# EAGLE design steamer-deck-ino (EAGLE 5.11)
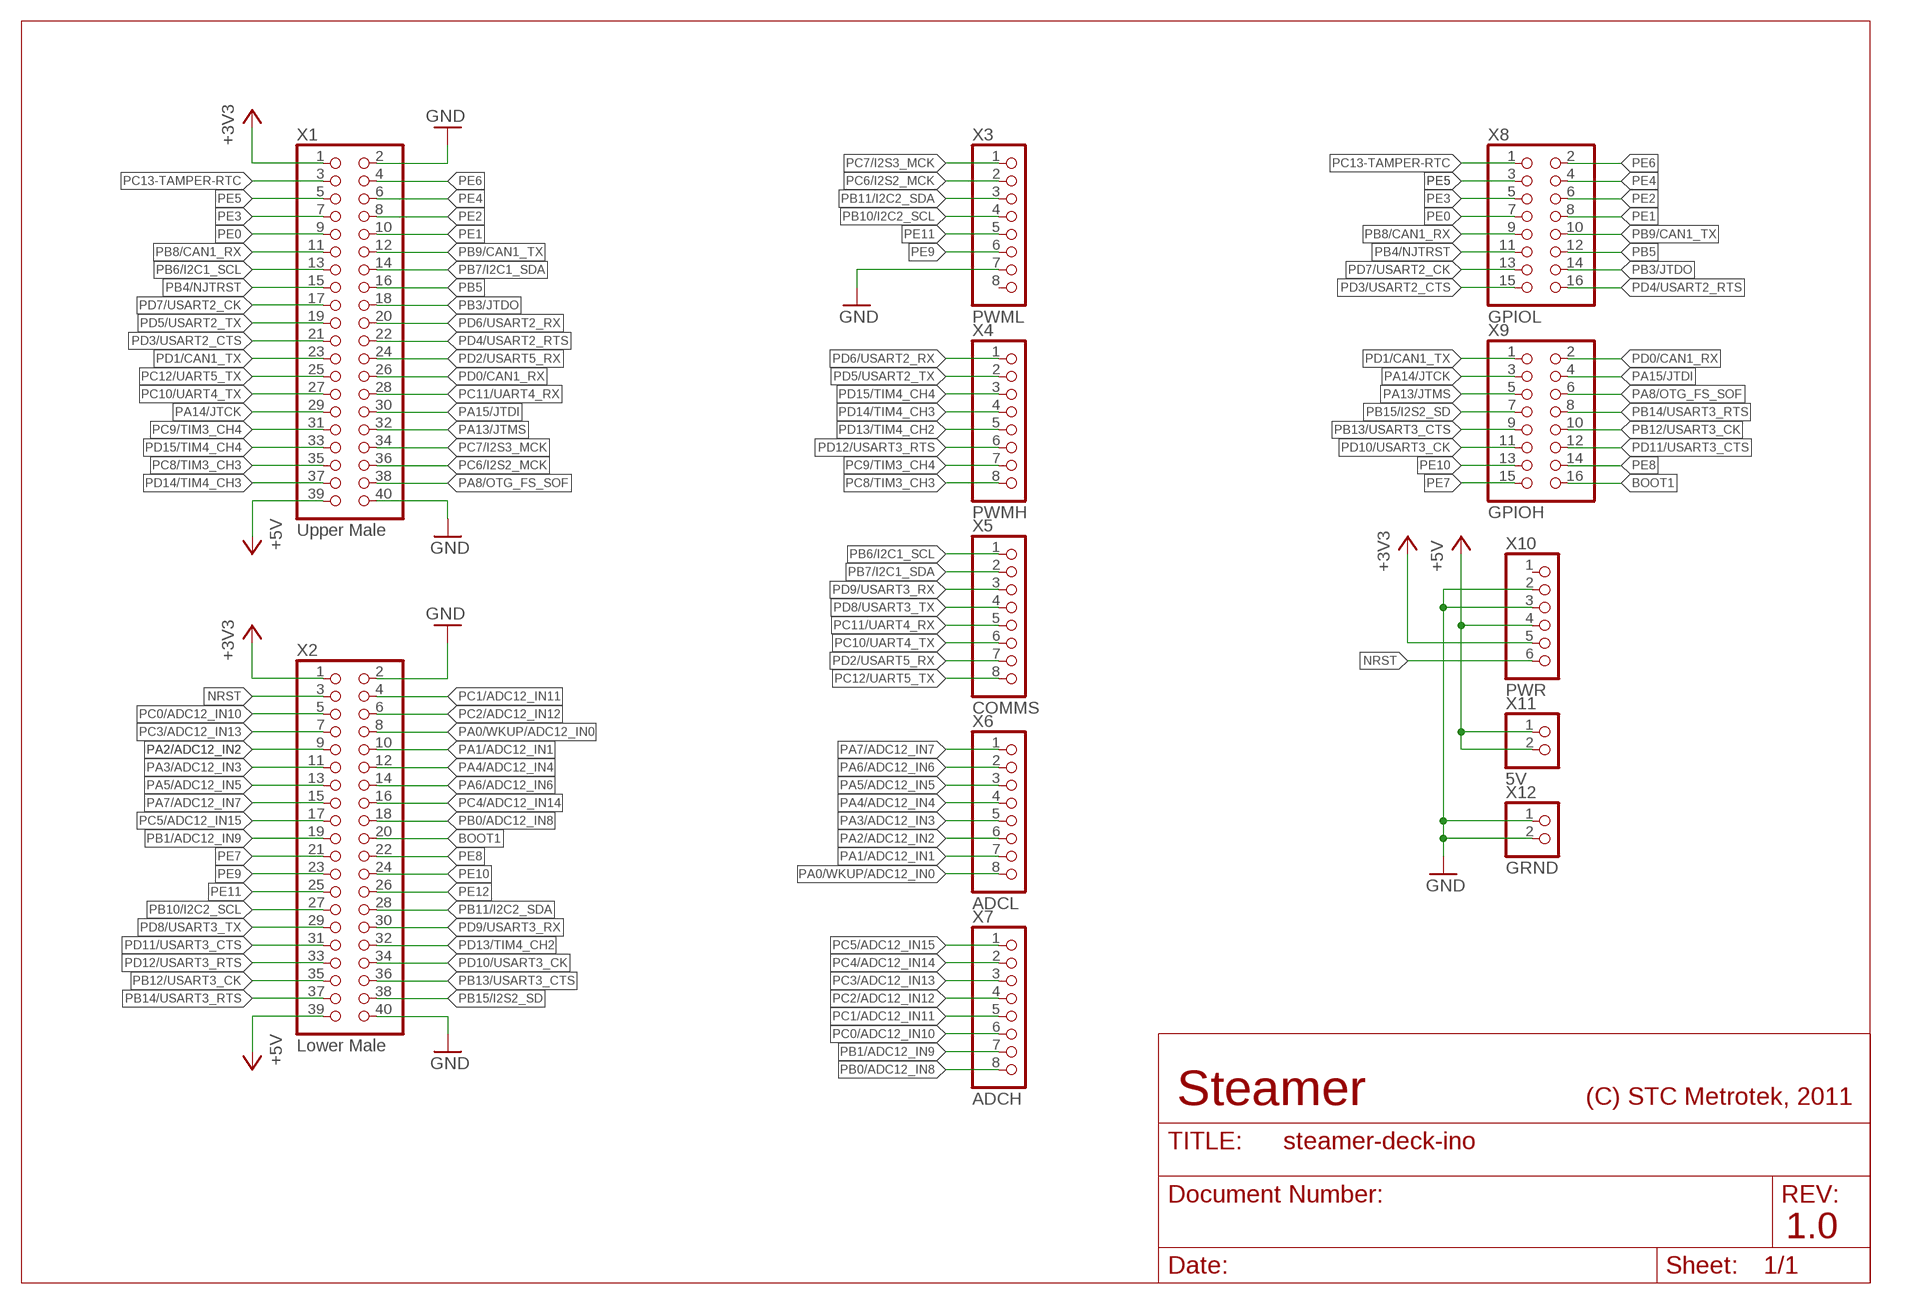
[diagram p0: schematic, sheet 1]

## Parts
X1  Upper Male  PINHD-2X20-M  [2X20SMD1-27-BB-M]
X2  Lower Male  PINHD-2X20-M  [2X20SMD1-27-BB-M]
X3  PWML  PINHD-1X8  [1X08]
X4  PWMH  PINHD-1X8  [1X08]
X5  COMMS  PINHD-1X8  [1X08]
X6  ADCL  PINHD-1X8  [1X08]
X7  ADCH  PINHD-1X8  [1X08]
X8  GPIOL  PINHD-2X8  [2X08]
X9  GPIOH  PINHD-2X8  [2X08]
X10  PWR  PINHD-1X6  [1X06]
X11  5V  PINHD-1X2  [1X02]
X12  GRND  PINHD-1X2  [1X02]

## Nets
+3V3: X1.1 X2.1 X10.5
+5V: X1.39 X2.39 X10.4 X11.1 X11.2
BOOT1: X2.20 X9.16
GND: X1.2 X1.40 X2.2 X2.40 X3.7 X10.2 X10.3 X12.1 X12.2
NRST: X2.3 X10.6
PA0/WKUP/ADC12_IN0: X2.8 X6.8
PA1/ADC12_IN1: X2.10 X6.7
PA2/ADC12_IN2: X2.9 X6.6
PA3/ADC12_IN3: X2.11 X6.5
PA4/ADC12_IN4: X2.12 X6.4
PA5/ADC12_IN5: X2.13 X6.3
PA6/ADC12_IN6: X2.14 X6.2
PA7/ADC12_IN7: X2.15 X6.1
PA8/OTG_FS_SOF: X1.38 X9.6
PA13/JTMS: X1.32 X9.5
PA14/JTCK: X1.29 X9.3
PA15/JTDI: X1.30 X9.4
PB0/ADC12_IN8: X2.18 X7.8
PB1/ADC12_IN9: X2.19 X7.7
PB3/JTDO: X1.18 X8.14
PB4/NJTRST: X1.15 X8.11
PB5: X1.16 X8.12
PB6/I2C1_SCL: X1.13 X5.1
PB7/I2C1_SDA: X1.14 X5.2
PB8/CAN1_RX: X1.11 X8.9
PB9/CAN1_TX: X1.12 X8.10
PB10/I2C2_SCL: X2.27 X3.4
PB11/I2C2_SDA: X2.28 X3.3
PB12/USART3_CK: X2.35 X9.10
PB13/USART3_CTS: X2.36 X9.9
PB14/USART3_RTS: X2.37 X9.8
PB15/I2S2_SD: X2.38 X9.7
PC0/ADC12_IN10: X2.5 X7.6
PC1/ADC12_IN11: X2.4 X7.5
PC2/ADC12_IN12: X2.6 X7.4
PC3/ADC12_IN13: X2.7 X7.3
PC4/ADC12_IN14: X2.16 X7.2
PC5/ADC12_IN15: X2.17 X7.1
PC6/I2S2_MCK: X1.36 X3.2
PC7/I2S3_MCK: X1.34 X3.1
PC8/TIM3_CH3: X1.35 X4.8
PC9/TIM3_CH4: X1.31 X4.7
PC10/UART4_TX: X1.27 X5.6
PC11/UART4_RX: X1.28 X5.5
PC12/UART5_TX: X1.25 X5.8
PC13-TAMPER-RTC: X1.3 X8.1
PD0/CAN1_RX: X1.26 X9.2
PD1/CAN1_TX: X1.23 X9.1
PD2/USART5_RX: X1.24 X5.7
PD3/USART2_CTS: X1.21 X8.15
PD4/USART2_RTS: X1.22 X8.16
PD5/USART2_TX: X1.19 X4.2
PD6/USART2_RX: X1.20 X4.1
PD7/USART2_CK: X1.17 X8.13
PD8/USART3_TX: X2.29 X5.4
PD9/USART3_RX: X2.30 X5.3
PD10/USART3_CK: X2.34 X9.11
PD11/USART3_CTS: X2.31 X9.12
PD12/USART3_RTS: X2.33 X4.6
PD13/TIM4_CH2: X2.32 X4.5
PD14/TIM4_CH3: X1.37 X4.4
PD15/TIM4_CH4: X1.33 X4.3
PE0: X1.9 X8.7
PE1: X1.10 X8.8
PE2: X1.8 X8.6
PE3: X1.7 X8.5
PE4: X1.6 X8.4
PE5: X1.5 X8.3
PE6: X1.4 X8.2
PE7: X2.21 X9.15
PE8: X2.22 X9.14
PE9: X2.23 X3.6
PE10: X2.24 X9.13
PE11: X2.25 X3.5
PE12: X2.26
Unconnected: X3.8 X10.1

## Notes on the sheet
- Steamer | (C) STC Metrotek, 2011
- 1.0

## Library data of the parts
X1 X2 = con-pinhd-2x20:PINHD-2X20: PIN HEADER
X3-X7 = steamer-pinhead:PINHD-1X8: PIN HEADER
X8 X9 = pinhead:PINHD-2X8: PIN HEADER
X10 = steamer-pinhead:PINHD-1X6: PIN HEADER
X11 X12 = steamer-pinhead:PINHD-1X2: PIN HEADER

## Net classes
0 default: width 0.254 mm
1 GND: width 0.305 mm
2 +3V3: width 0.305 mm
3 +5V: width 0.305 mm
4 USB_VDD: width 0.254 mm
5 SUPP: width 0.305 mm

## Board
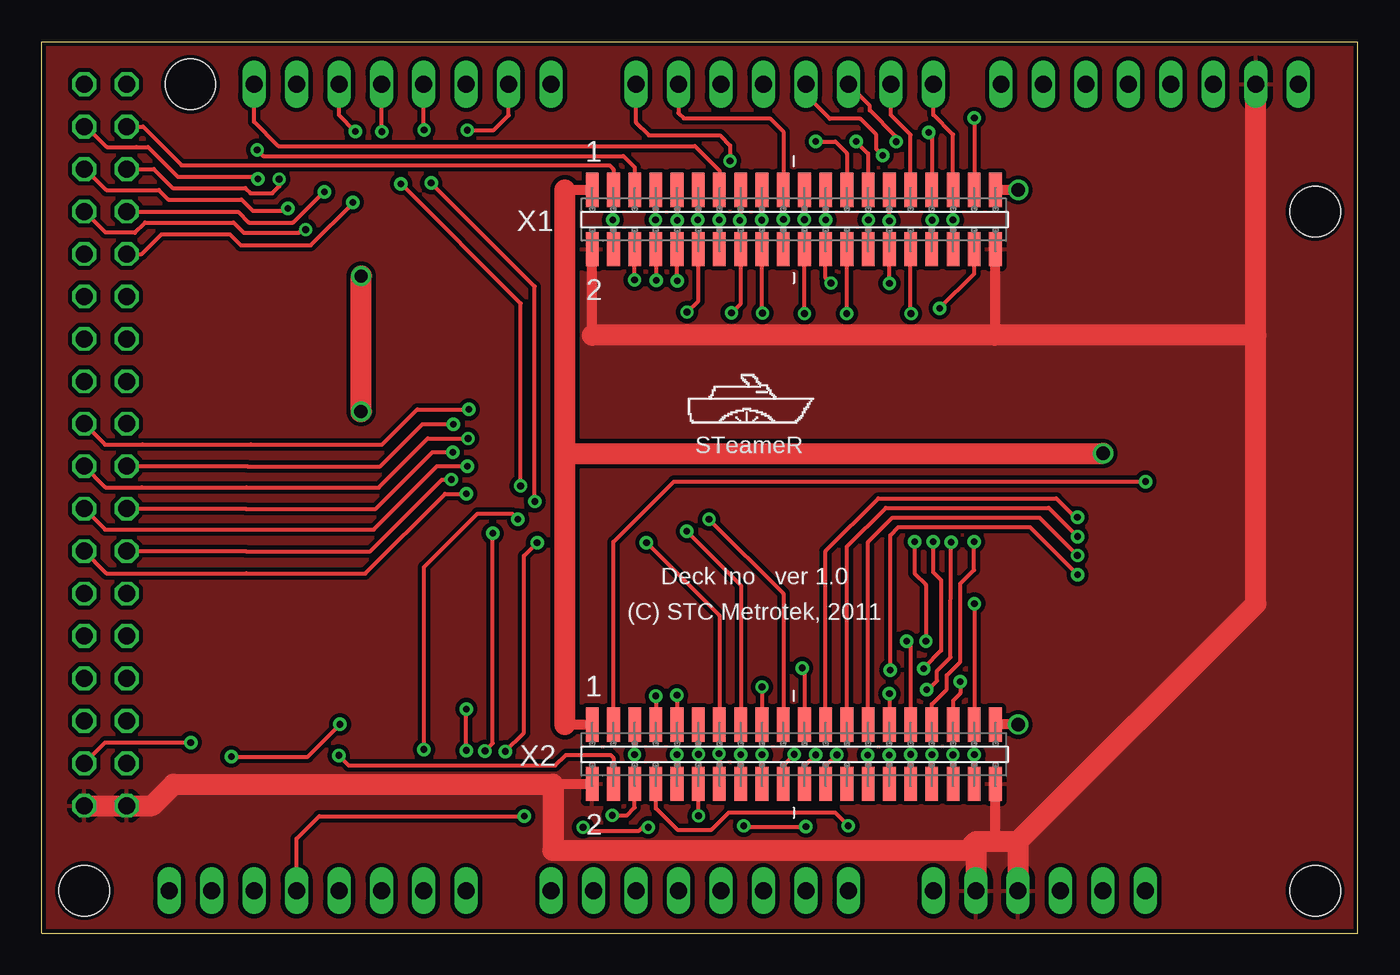
[diagram p1: board, top side]
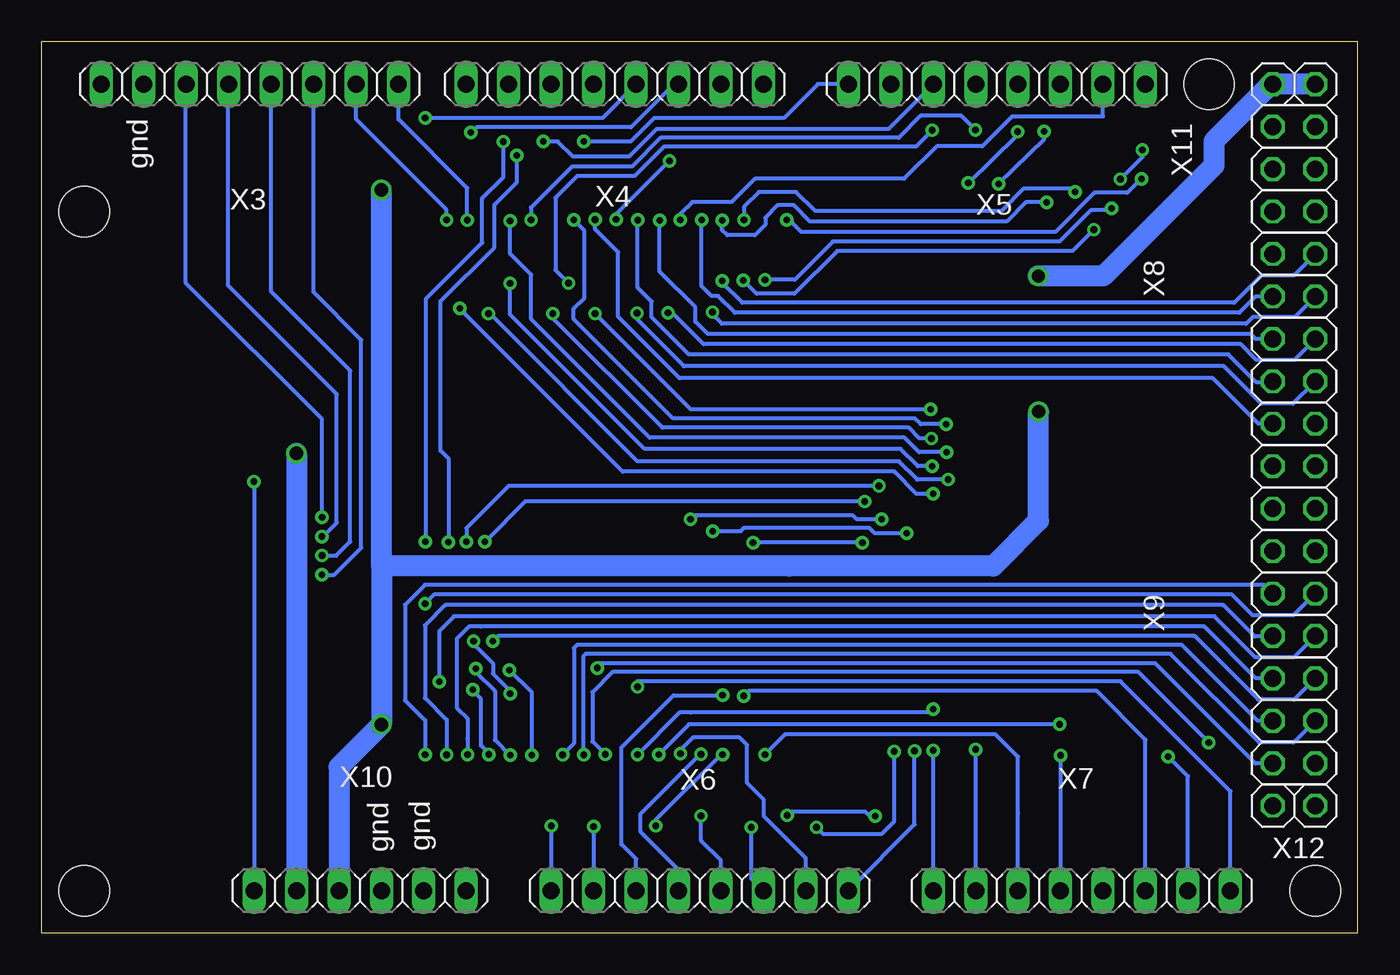
[diagram p2: board, bottom side, seen from below]

Size 78.74 x 53.34 mm. Coordinates in mm from the lower left corner, seen from the top.
Outline: 0,0 0,53.34 78.74,53.34 78.74,0 0,0
Copper layers (1*16): Top 0.035mm / dielectric 1.43mm / Bottom 0.035mm
Design rules "default *": minimum track width 10mil, minimum drill 0.4mm, track to track 10mil, track to pad 10mil, pad to pad 10mil, via to via 10mil, smd to smd 10mil, copper to edge 0.25mm, drill to drill 0.4mm, minimum pad ring 0.2mm, minimum via ring 0.2mm, stop-mask expansion 0.1mm, vias tented up to drill 0.4mm, thermal gap 12mil
Holes 3 mm at 8.89,50.8 76.2,2.54 76.2,43.18 2.54,2.54

### Footprints (pad centres in the part's own frame; a part is rotated, then mirrored left to right if it is on the bottom)
2X20SMD1-27-BB-M = smd 0.76 x 2.05: 1 -12.065,1.775; 2 -12.065,-1.775; 3 -10.795,1.775; 4 -10.795,-1.775; 5 -9.525,1.775; 6 -9.525,-1.775; 7 -8.255,1.775; 8 -8.255,-1.775; 9 -6.985,1.775; 10 -6.985,-1.775; 11 -5.715,1.775; 12 -5.715,-1.775; 13 -4.455,1.775; 14 -4.455,-1.775; 15 -3.175,1.775; 16 -3.175,-1.775; 17 -1.905,1.775; 18 -1.905,-1.775; 19 -0.635,1.775; 20 -0.635,-1.775; 21 0.635,1.775; 22 0.635,-1.775; 23 1.905,1.775; 24 1.905,-1.775; 25 3.175,1.775; 26 3.175,-1.775; 27 4.445,1.775; 28 4.445,-1.775; 29 5.715,1.775; 30 5.715,-1.775; 31 6.985,1.775; 32 6.985,-1.775; 33 8.255,1.775; 34 8.255,-1.775; 35 9.525,1.775; 36 9.525,-1.775; 37 10.795,1.775; 38 10.795,-1.775; 39 12.065,1.775; 40 12.065,-1.775
1X08 = drill 1.016 long: 1 -8.89,0; 2 -6.35,0; 3 -3.81,0; 4 -1.27,0; 5 1.27,0; 6 3.81,0; 7 6.35,0; 8 8.89,0
2X08 = drill 1.016 octagon: 1 -8.89,-1.27; 2 -8.89,1.27; 3 -6.35,-1.27; 4 -6.35,1.27; 5 -3.81,-1.27; 6 -3.81,1.27; 7 -1.27,-1.27; 8 -1.27,1.27; 9 1.27,-1.27; 10 1.27,1.27; 11 3.81,-1.27; 12 3.81,1.27; 13 6.35,-1.27; 14 6.35,1.27; 15 8.89,-1.27; 16 8.89,1.27
1X06 = drill 1.016 long: 1 -6.35,0; 2 -3.81,0; 3 -1.27,0; 4 1.27,0; 5 3.81,0; 6 6.35,0
1X02 = drill 1.016 octagon: 1 -1.27,0; 2 1.27,0

### Placement (x,y rotation side)
X1  45,42.7 0 top
X2  45,10.7 0 top
X3  66.29,50.8 180 bottom
X4  44.45,50.8 180 bottom
X5  21.59,50.8 180 bottom
X6  39.37,2.54 180 bottom
X7  16.51,2.54 180 bottom
X8  3.81,39.37 270 bottom
X9  3.81,19.05 270 bottom
X10  59.69,2.54 180 bottom
X11  3.81,50.8 0 bottom
X12  3.81,7.62 0 bottom

### Tracks (layer width: path | path; a pad name or v marks a point on that pad's centre or on a via)
+3V3  (via drill 0.8)
  Top 0.61: 31.3,12.47 X2.1 | 31.3,44.49 X1.1
  Top 1.27: 31.3,28.76 31.3,44.49 | v63.51,28.7 31.36,28.7 31.3,28.76 | 31.3,12.47 31.3,28.76
  Bottom 1.27: v63.51,28.7 X10.5
+5V  (via drill 0.8)
  Top 0.61: X2.39 v58.42,12.48 | v58.42,44.48 X1.39
  Top 1.27: v19.11,39.32 v19.11,31.22 v19.1,31.21
  Bottom 1.27: X10.4 60.96,9.94 v58.42,12.48 58.42,21.98 | 58.42,21.98 v58.42,44.48 | X11.2 X11.1 5.2,50.8 8.61,47.39 | 58.42,21.98 34.02,21.98 34.01,21.97 21.81,21.97 19.1,24.68 v19.1,31.21 | 8.61,47.39 8.6,47.38 | 8.61,47.39 8.61,45.94 15.23,39.32 v19.11,39.32
BOOT1  (via drill 0.4)
  Top 0.254: v8.91,11.4 3.79,11.4 X9.16 | X2.20 44.37,10.04 v45.02,10.7
  Bottom 0.254: v8.91,11.4 13.12,15.62 44.59,15.62 45.79,14.41 45.79,11.47 v45.02,10.7
GND
  Top 0.61: 32.93,35.78 X1.2 | X1.40 57.06,35.78 57.03,35.78 | 57.06,5.48 X2.40 | X2.2 30.59,8.93 30.59,8.91
  Top 1.27: 72.64,35.78 X3.7 | 32.93,35.78 57.03,35.78 72.64,35.78 | X12.2 X12.1 6.6,7.62 7.89,8.91 30.59,8.91 30.59,4.96 30.59,4.95 55.38,4.95 55.91,5.48 | 55.91,5.48 57.06,5.48 58.42,5.48 | 58.42,5.48 X10.3 | X10.2 55.91,2.54 55.91,5.48 | 58.42,5.48 72.64,19.7 72.64,35.78
  pour Top: 0,0 78.74,0 78.74,53.31 0,53.31
NRST  (via drill 0.4)
  Top 0.254: v66.05,27.02 37.82,27.02 34.21,23.41 X2.3
  Bottom 0.254: X10.6 v66.04,27.01 v66.05,27.02
PA0/WKUP/ADC12_IN0  (via drill 0.4)
  Top 0.254: X2.8 36.74,7.46 38.03,6.18 40.07,6.18 41.11,7.22 47.46,7.22 v48.26,6.42
  Bottom 0.254: v48.26,6.42 X6.8
PA1/ADC12_IN1  (via drill 0.4)
  Top 0.254: X2.10 v38.02,10.67 v38.01,10.68 | v42.01,6.42 42.05,6.37 v45.72,6.37
  Bottom 0.254: v38.01,10.68 38.17,10.68 38.17,10.62 42.01,6.78 v42.01,6.42 | v45.72,6.37 X6.7
PA2/ADC12_IN2  (via drill 0.4)
  Top 0.254: X2.9 38.02,14.31 v38.01,14.23
  Bottom 0.254: v38.01,14.23 40.94,14.23 44.06,11.11 44.06,5.31 43.18,4.43 X6.6
PA3/ADC12_IN3  (via drill 0.4)
  Top 0.254: X2.11 39.28,10.71 v39.3,10.7
  Bottom 0.254: v39.3,10.7 39.35,10.7 42.91,7.14 42.91,6.06 40.64,3.79 X6.5
PA4/ADC12_IN4  (via drill 0.4)
  Top 0.254: X2.12 39.28,7.03 v39.3,7.02
  Bottom 0.254: v39.3,7.02 39.3,5.53 38.1,4.34 X6.4
PA5/ADC12_IN5  (via drill 0.4)
  Top 0.254: X2.13 40.55,19 v36.18,23.37 | v27.73,10.87 28.85,11.99 28.85,22.57 v29.64,23.36 v29.64,23.37 | v32.39,6.33 32.59,6.13 35.75,6.13 35.95,6.33 v36.29,6.33
  Bottom 0.254: X6.3 36.29,3.27 v36.29,6.33 | v32.39,6.33 31.98,5.92 28.5,5.92 27.73,6.69 v27.73,10.87 | v29.64,23.37 v36.18,23.37
PA6/ADC12_IN6  (via drill 0.4)
  Top 0.254: X2.14 40.55,10.72 v40.52,10.74
  Bottom 0.254: v40.52,10.74 40.52,10.95 39.77,11.71 36.98,11.71 36.53,11.26 36.53,8.98 35.53,7.98 35.53,7 33.02,4.48 X6.2
PA7/ADC12_IN7  (via drill 0.4)
  Top 0.254: X2.15 41.83,20.82 v38.6,24.04 | v26.98,23.92 26.98,11.36 v26.52,10.9
  Bottom 0.254: v38.6,24.04 36.93,24.04 36.74,24.23 29.21,24.23 28.9,23.92 v26.98,23.92 | v26.52,10.9 26.52,6.5 X6.1
PA8/OTG_FS_SOF  (via drill 0.4)
  Top 0.254: X9.6 3.87,21.54 12.24,21.54 12.26,21.52 19.36,21.52 24.13,26.29 v25.4,26.29 | X1.38 55.8,39.47 v53.73,37.4
  Bottom 0.254: v25.4,26.29 26.41,26.29 27.73,27.61 43.99,27.61 53.45,37.08 53.45,37.12 v53.73,37.4
PA13/JTMS  (via drill 0.4)
  Top 0.254: X1.32 51.98,37.09 v52.01,37.07 | X9.5 12.19,22.86 12.2,22.85 19.66,22.85 23.95,27.14 v24.5,27.14
  Bottom 0.254: v24.5,27.14 v24.51,27.14 26.36,27.14 27.45,28.23 43.08,28.23 51.92,37.07 v52.01,37.07
PA14/JTCK  (via drill 0.4)
  Top 0.254: v50.72,42.62 X1.29 | X9.3 6.22,25.41 6.23,25.4 12.2,25.4 12.21,25.39 19.98,25.39 23.37,28.78 v24.59,28.78
  Bottom 0.254: v50.72,42.62 50.72,40.66 49.46,39.41 49.46,36.74 42.37,29.65 27.12,29.65 26.25,28.78 v24.59,28.78
PA15/JTDI  (via drill 0.4)
  Top 0.254: X9.4 3.79,24.14 12.18,24.14 12.18,24.15 19.86,24.15 23.65,27.94 v25.45,27.94 v25.46,27.93 | X1.30 v50.72,38.88
  Bottom 0.254: v50.72,38.88 v50.71,38.87 50.71,37.01 42.67,28.97 27.35,28.97 26.32,27.94 v25.46,27.94 v25.46,27.93
PB0/ADC12_IN8  (via drill 0.4)
  Top 0.254: v43.09,10.68 X2.18 | v25.4,10.93 v25.4,13.41
  Bottom 0.254: v43.09,10.68 40.58,13.2 39.91,13.2 39.88,13.21 25.59,13.21 v25.4,13.41 | X7.8 v25.4,10.93
PB1/ADC12_IN9  (via drill 0.4)
  Top 0.254: X2.19 44.37,20.32 v39.92,24.76 | v28.49,24.76 28.14,25.11 26.08,25.11 22.87,21.9 v22.87,10.99
  Bottom 0.254: X7.7 v22.86,10.98 v22.87,10.99 | v39.92,24.76 39.7,24.98 30.19,24.98 29.97,24.76 v28.49,24.76
PB3/JTDO  (via drill 0.4)
  Top 0.254: X1.18 43.09,37.12 v43.12,37.1
  Bottom 0.254: v43.12,37.1 43.12,36.73 40.32,33.93 8.02,33.93 5.77,31.68 3.88,31.68 X8.14
PB4/NJTRST  (via drill 0.4)
  Top 0.254: X1.15 41.83,42.7 v41.77,42.65
  Bottom 0.254: v41.77,42.65 41.77,39.6 39.63,37.46 39.63,36.59 38.89,35.85 6.39,35.85 6.1,35.56 X8.11
PB5  (via drill 0.4)
  Top 0.254: X1.16 41.83,37.67 v41.27,37.12
  Bottom 0.254: v41.27,37.12 41.02,37.12 39.14,35.24 7,35.24 6.06,34.3 3.8,34.3 X8.12
PB6/I2C1_SCL
  Top 0.254: X1.13 40.55,45.64 39.08,47.1 14.15,47.1 12.7,48.55 X5.1
PB7/I2C1_SDA  (via drill 0.4)
  Top 0.254: X1.14 v40.55,42.68 v40.54,42.69
  Bottom 0.254: v40.54,42.69 40.54,43.02 39.8,43.75 37.47,43.75 36.08,45.14 27.14,45.14 25.19,47.09 22.46,47.09 20.68,48.87 15.24,48.87 X5.2
PB8/CAN1_RX  (via drill 0.4)
  Top 0.254: X1.11 39.28,42.7 v39.26,42.67
  Bottom 0.254: v39.26,42.67 39.26,38.7 38.68,38.13 38.27,38.13 37.27,37.13 7.08,37.13 6.13,38.08 5.1,38.08 X8.9
PB9/CAN1_TX  (via drill 0.4)
  Top 0.254: X1.12 39.28,37.84 v38.61,37.16
  Bottom 0.254: v38.61,37.16 38.61,37.04 38.04,36.47 6.67,36.47 6.27,36.87 3.77,36.87 X8.10
PB10/I2C2_SCL  (via drill 0.4)
  Top 0.254: v61.97,22.59 59.7,24.87 50.91,24.87 49.45,23.41 X2.27
  Bottom 0.254: v61.97,22.59 61.12,22.59 60.28,23.43 60.28,33.66 65.03,38.4 X3.4
PB11/I2C2_SDA  (via drill 0.4)
  Top 0.254: X2.28 49.45,10.62 v49.41,10.65 | v61.98,21.45 v61.98,21.44 59.13,24.29 51.25,24.29 50.77,23.8 v50.77,15.74
  Bottom 0.254: 50.74,15.71 v50.77,15.74 49.41,14.39 v49.41,10.65 | v61.98,21.44 61.24,21.44 59.62,23.06 59.62,35.5 62.48,38.36 X3.3
PB12/USART3_CK  (via drill 0.4)
  Top 0.254: X2.35 54.52,13.91 54.96,14.35 v54.96,15.04
  Bottom 0.254: X9.10 3.81,16.5 6.13,16.5 8.57,18.95 54.07,18.95 54.96,18.06 v54.96,15.04
PB13/USART3_CTS  (via drill 0.4)
  Top 0.254: X2.36 v54.52,10.66 v54.52,10.67
  Bottom 0.254: X9.9 5.12,17.74 6.16,17.74 8.05,19.63 54.6,19.63 55.81,18.43 55.81,14.06 54.52,12.77 v54.52,10.67
PB14/USART3_RTS  (via drill 0.4)
  Top 0.254: X2.37 v55.8,19.71 v55.8,19.72
  Bottom 0.254: X9.8 3.85,19.01 6.28,19.01 7.53,20.25 55.27,20.25 v55.8,19.73 v55.8,19.72
PB15/I2S2_SD  (via drill 0.4)
  Top 0.254: X2.38 v55.8,10.67 v55.8,10.68
  Bottom 0.254: v55.8,10.68 55.8,12.73 57.01,13.94 57.01,19.64 55.81,20.84 5.59,20.84 X9.7
PC0/ADC12_IN10  (via drill 0.4)
  Top 0.254: X2.5 v35.48,10.69 v35.47,10.69
  Bottom 0.254: X7.6 20.34,2.56 20.34,7.18 20.33,7.19 20.33,10.55 21.66,11.88 34.27,11.88 v35.47,10.69
PC1/ADC12_IN11  (via drill 0.4)
  Top 0.254: X2.4 34.2,10.49 34.05,10.65 31.36,10.65 30.73,10.03 18.38,10.03 v17.77,10.63 17.8,10.65
  Bottom 0.254: v17.77,10.63 X7.5
PC2/ADC12_IN12  (via drill 0.4)
  Top 0.254: v28.86,7 16.6,7 15.24,5.64 X7.4 | X2.6 35.48,7.51 35.01,7.04 v34.15,7.04
  Bottom 0.254: v34.15,7.04 33.93,7.26 29.46,7.26 29.2,7 v28.86,7
PC3/ADC12_IN13  (via drill 0.4)
  Top 0.254: v36.74,14.19 X2.7
  Bottom 0.254: X7.3 12.7,11.57 15.61,14.48 36.45,14.48 v36.74,14.19
PC4/ADC12_IN14  (via drill 0.4)
  Top 0.254: v11.34,10.56 15.91,10.56 v17.84,12.49 | v41.83,10.68 X2.16
  Bottom 0.254: X7.2 10.16,9.38 v11.34,10.56 | v17.84,12.49 40.02,12.49 v41.83,10.68
PC5/ADC12_IN15  (via drill 0.4)
  Top 0.254: v43.09,14.73 X2.17
  Bottom 0.254: X7.1 7.62,8.49 14.2,15.07 43.09,15.07 v43.09,14.73
PC6/I2S2_MCK  (via drill 0.4)
  Top 0.254: X1.36 v54.52,42.67
  Bottom 0.254: X3.2 59.95,48.72 54.52,43.29 v54.52,42.67
  Bottom 0.305: X3.2
PC7/I2S3_MCK  (via drill 0.4)
  Top 0.254: X1.34 53.26,42.63 v53.28,42.66
  Bottom 0.254: v53.28,42.66 v53.29,42.67 53.29,44.59 57.4,48.7 X3.1
PC8/TIM3_CH3
  Top 0.254: X1.35 54.52,47.79 53.34,48.98 X4.8
PC9/TIM3_CH4
  Top 0.254: X1.31 51.98,47.77 50.8,48.96 X4.7
PC10/UART4_TX  (via drill 0.4)
  Top 0.254: X1.27 49.45,46.65 v48.73,47.37
  Bottom 0.254: v48.73,47.37 47.87,47.37 46.97,46.47 43.59,46.47 41.95,48.12 28.09,48.12 X5.6
PC11/UART4_RX  (via drill 0.4)
  Top 0.254: X1.28 49.47,40.95 v49.47,42.69 | X5.5 22.86,48.08 v22.88,48.06
  Bottom 0.254: v49.47,42.69 49.47,43.42 47.01,45.88 43.44,45.88 41.72,47.6 27.46,47.6 26.16,48.91 23.71,48.91 v22.88,48.06
PC12/UART5_TX  (via drill 0.4)
  Top 0.254: X1.25 48.17,46.67 47.48,47.37 v46.31,47.37
  Bottom 0.254: X5.8 32.3,50.81 34.34,48.77 42.09,48.77 43.5,47.37 v46.31,47.37
PC13-TAMPER-RTC
  Top 0.254: 5.58,48.26 X8.1 6.05,48.26 8.37,45.95 33.98,45.95 34.2,45.72 X1.3
PD0/CAN1_RX  (via drill 0.4)
  Top 0.254: X1.26 v48.17,37.08 | X9.2 3.8,26.68 5.97,26.68 5.99,26.67 12.23,26.67 12.24,26.66 20.16,26.66 23.1,29.6 v25.5,29.6
  Bottom 0.254: v25.5,29.6 26.22,29.6 26.86,30.24 41.61,30.24 48.17,36.8 v48.17,37.08
PD1/CAN1_TX  (via drill 0.4)
  Top 0.254: X1.23 v46.91,42.68 v46.91,42.67 | X9.1 12.29,27.94 12.3,27.93 20.25,27.93 22.77,30.45 v24.63,30.45
  Bottom 0.254: v46.91,42.67 46.27,42.03 46.27,38.01 46.91,37.36 46.91,36.75 40.96,30.8 26.5,30.8 26.15,30.45 v24.64,30.45 v24.63,30.45
PD2/USART5_RX  (via drill 0.4)
  Top 0.254: X1.24 46.91,39.21 v47.22,38.9 | v25.46,48.05 27.05,48.05 27.94,48.95 X5.7
  Bottom 0.254: v47.22,38.9 48.01,39.68 48.01,44.01 46.71,45.3 43.27,45.3 41.51,47.08 26.43,47.08 v25.46,48.05
PD3/USART2_CTS  (via drill 0.4)
  Top 0.254: X1.21 v45.63,42.7
  Bottom 0.254: v45.63,42.7 45.63,42.13 44.25,40.75 44.25,36.89 40.57,33.21 8.67,33.21 5.94,30.48 X8.15
PD4/USART2_RTS  (via drill 0.4)
  Top 0.254: v45.63,37.07 X1.22 | X8.16 3.79,29.23 6.01,29.23 6.03,29.24 12.52,29.24 12.53,29.23 20.36,29.23 22.47,31.34 v25.55,31.34
  Bottom 0.254: 25.57,31.32 v25.55,31.34 39.91,31.34 v45.63,37.07
PD5/USART2_TX
  Top 0.254: X1.19 44.37,47.97 43.57,48.76 38.41,48.76 38.09,49.08 X4.2
PD6/USART2_RX  (via drill 0.4)
  Top 0.254: X1.20 44.37,42.7 v44.38,42.72 | v41.18,46.22 v41.19,46.22 41.19,47.13 40.58,47.74 36.33,47.74 35.56,48.51 X4.1
  Bottom 0.254: v44.38,42.72 44.38,43.02 v41.18,46.22
PD7/USART2_CK  (via drill 0.4)
  Top 0.254: X1.17 v43.08,42.67
  Bottom 0.254: v43.08,42.67 43.08,38.63 42.25,37.8 42.25,36.86 40.02,34.63 7.73,34.63 6.09,32.99 5.11,32.99 X8.13
PD8/USART3_TX  (via drill 0.4)
  Top 0.254: v50.72,14.32 X2.29 | v52.9,17.46 52.9,20.86 52.23,21.52 v52.23,23.42 | X5.4 20.32,47.98 v20.34,47.96 | v23.3,44.89 29.5,38.69 v29.5,25.83
  Bottom 0.254: v50.72,14.32 50.72,14.49 51.75,15.53 51.75,16.14 52.9,17.29 v52.9,17.46 | v20.34,47.96 20.34,47.78 v23.3,44.89 | v29.5,25.83 49.82,25.83 v52.23,23.42
PD9/USART3_RX  (via drill 0.4)
  Top 0.254: X2.30 v50.72,10.64 v50.71,10.65 | v52.77,15.81 52.77,15.88 53.81,16.91 53.81,21.13 53.33,21.61 v53.33,23.41 | X5.3 17.78,48.95 v18.76,47.97 | v21.49,44.84 28.65,37.68 v28.65,26.76
  Bottom 0.254: v50.71,10.65 v50.72,10.65 51.62,11.55 51.62,14.48 52.77,15.63 v52.77,15.81 | v18.76,47.97 18.76,47.51 v21.49,44.84 | v28.65,26.76 50.8,26.76 53.33,24.23 v53.33,23.41
PD10/USART3_CK  (via drill 0.4)
  Top 0.254: X2.34 53.26,10.67 v53.27,10.68
  Bottom 0.254: X9.11 6.09,15.24 9.19,18.34 52.45,18.34 52.46,18.34 53.17,18.34 53.91,17.61 53.91,13.48 53.27,12.85 53.27,11.65 53.27,11.64 v53.27,10.68
PD11/USART3_CTS  (via drill 0.4)
  Top 0.254: X2.31 51.98,17.23 v51.74,17.48
  Bottom 0.254: v51.74,17.48 v51.73,17.48 51.43,17.77 9.76,17.77 5.96,13.97 3.81,13.97 X9.12
PD12/USART3_RTS  (via drill 0.4)
  Top 0.254: X2.33 53.26,13.7 54.15,14.59 54.15,15.43 54.96,16.23 54.96,20.91 55.78,21.73 v55.78,23.41 | 48.26,50.31 X4.6 49.55,49.51 49.55,49.23 51.12,47.66 v51.12,47.36
  Bottom 0.254: v51.12,47.36 51.12,45.24 52.39,43.97 52.39,41.32 55.75,37.96 55.75,23.45 v55.78,23.41
PD13/TIM4_CH2  (via drill 0.4)
  Top 0.254: X2.32 v51.98,10.69 v51.99,10.69 | v52.95,14.56 53,14.53 53.57,15.1 53.57,15.7 54.38,16.5 v54.41,23.4 | X4.5 45.72,50.16 47.15,48.73 48.98,48.73 49.93,47.78 49.93,46.92 v50.31,46.54
  Bottom 0.254: v51.99,10.69 51.99,10.74 52.47,11.22 52.47,14.01 v52.95,14.56 | v50.31,46.54 50.31,44.94 51.66,43.59 51.66,41.03 54.88,37.81 54.88,28.87 54.37,28.36 54.37,23.44 v54.41,23.4
PD14/TIM4_CH3  (via drill 0.4)
  Top 0.254: X1.37 v55.8,48.77 v55.8,48.78
  Bottom 0.254: v55.8,48.78 45.2,48.78 X4.4
PD15/TIM4_CH4  (via drill 0.4)
  Top 0.254: X1.33 53.26,47.73 v53.06,47.92
  Bottom 0.254: 52.81,48.12 52.72,48.23 43.49,48.23 42.73,48.99 42.44,49.27 40.91,50.8 X4.3
  Bottom 0.305: v53.06,47.92 53.02,47.92 52.81,48.12
PE0  (via drill 0.4)
  Top 0.254: X8.7 5.99,40.64 7.17,41.82 11.25,41.82 11.91,41.16 16.09,41.16 18.61,43.69 v18.61,43.73 | X1.9 v38.02,42.66
  Bottom 0.254: v38.02,42.66 38.02,42.07 37.72,41.77 36.08,41.77 35.45,42.4 35.45,42.81 34.71,43.55 33.74,43.55 32.78,42.59 21,42.59 19.86,43.73 v18.61,43.73
PE1  (via drill 0.4)
  Top 0.254: X1.10 38.02,39.05 v38.03,39.03
  Bottom 0.254: v38.03,39.03 38.03,38.94 36.82,37.73 7.39,37.73 5.74,39.38 3.8,39.38 X8.8
PE2  (via drill 0.4)
  Top 0.254: X8.6 2.56,43.18 3.8,41.94 5.54,41.94 5.57,41.91 6.18,42.52 11.48,42.52 12.09,41.91 15.38,41.91 15.57,42.1 v15.79,42.1 | X1.8 36.77,40.9 v36.77,39.06
  Bottom 0.254: v36.77,39.06 35.97,38.26 33.7,38.26 31.14,40.82 17.07,40.82 v15.79,42.1
PE3  (via drill 0.4)
  Top 0.254: 5.33,43.18 X8.5 11.74,43.17 12.39,42.52 15.03,42.52 16.86,44.35 v16.91,44.35 | X1.7 36.72,44.5 v36.72,42.68
  Bottom 0.254: v36.72,42.68 36.72,43.46 35.83,44.35 33.6,44.35 32.46,43.21 21.33,43.21 20,44.55 17.11,44.55 v16.91,44.35
PE4  (via drill 0.4)
  Top 0.254: X8.4 2.61,45.72 3.86,44.47 7,44.47 7.57,43.9 11.95,43.9 12.62,43.23 14.73,43.23 v14.73,43.36 | X1.6 v35.47,39.09
  Bottom 0.254: v14.73,43.36 14.85,43.25 15.97,43.25 17.84,41.38 31.4,41.38 33.68,39.1 v35.46,39.1 v35.47,39.09
PE5  (via drill 0.4)
  Top 0.254: 5.24,45.72 X8.3 6.7,45.72 7.83,44.59 12.18,44.59 12.49,44.27 13.79,44.27 14.21,44.7 v14.21,45.12 | X1.5 35.48,45.83 34.8,46.51 13.26,46.51 v12.88,46.88
  Bottom 0.254: v12.88,46.88 12.88,46.44 v14.21,45.12
PE6  (via drill 0.4)
  Top 0.254: X8.2 2.67,48.26 3.89,47.03 5.66,47.03 5.67,47.04 6.36,47.04 8.14,45.26 12.81,45.26 v12.94,45.12 | X1.4 34.17,40.96 v34.17,42.67
  Bottom 0.254: v34.17,42.67 34.02,42.67 33.29,41.95 18.09,41.95 15.74,44.3 13.79,44.3 12.96,45.12 v12.94,45.12
PE7  (via drill 0.4)
  Top 0.254: X2.21 45.63,15.86 v45.5,15.87
  Bottom 0.254: v45.5,15.87 45.6,15.88 45.34,16.14 12.12,16.14 6.12,10.14 5.09,10.14 X9.15
PE8  (via drill 0.4)
  Top 0.254: X2.22 45.63,9.99 v46.31,10.67
  Bottom 0.254: X9.14 3.84,11.4 5.89,11.4 11.21,16.71 46.19,16.71 46.34,16.55 46.34,10.7 v46.31,10.67
PE9  (via drill 0.4)
  Top 0.254: v61.97,24.89 61.82,24.89 60.7,26.01 50.06,26.01 46.91,22.86 X2.23
  Bottom 0.254: v61.97,24.89 61.97,30.76 70.12,38.91 70.12,50.78 X3.6
PE10  (via drill 0.4)
  Top 0.254: X2.24 46.91,10 v47.58,10.67
  Bottom 0.254: X9.13 5.99,12.7 10.54,17.25 46.71,17.25 46.91,17.05 46.91,11.34 v47.58,10.67
PE11  (via drill 0.4)
  Top 0.254: v61.97,23.73 v61.98,23.73 60.26,25.45 50.5,25.45 48.17,23.12 X2.25
  Bottom 0.254: v61.98,23.73 61.91,23.73 61.09,24.55 61.09,32.26 67.58,38.74 67.58,50.79 X3.5

### Text on the board
tPlace: STeameR | Deck Ino ver 1.0 | (C) STC Metrotek, 2011
bPlace: gnd | gnd | gnd